# Altium schematic sheet Bluetooth.SchDoc: Transmission Circuit
size B; Date: 2/27/2025; Author: Brach Knutson; Organization: ORGANIZATION; Address1: ADDRESS 1; Address2: ADDRESS 2; Address3: ADDRESS 3; Address4: ADDRESS 4; Revision: -; SheetNumber: 4; SheetTotal: 6; ENG_APP_DATE: --/--/--; DSN_APP_DATE: --/--/--; CHK_APP_DATE: --/--/--
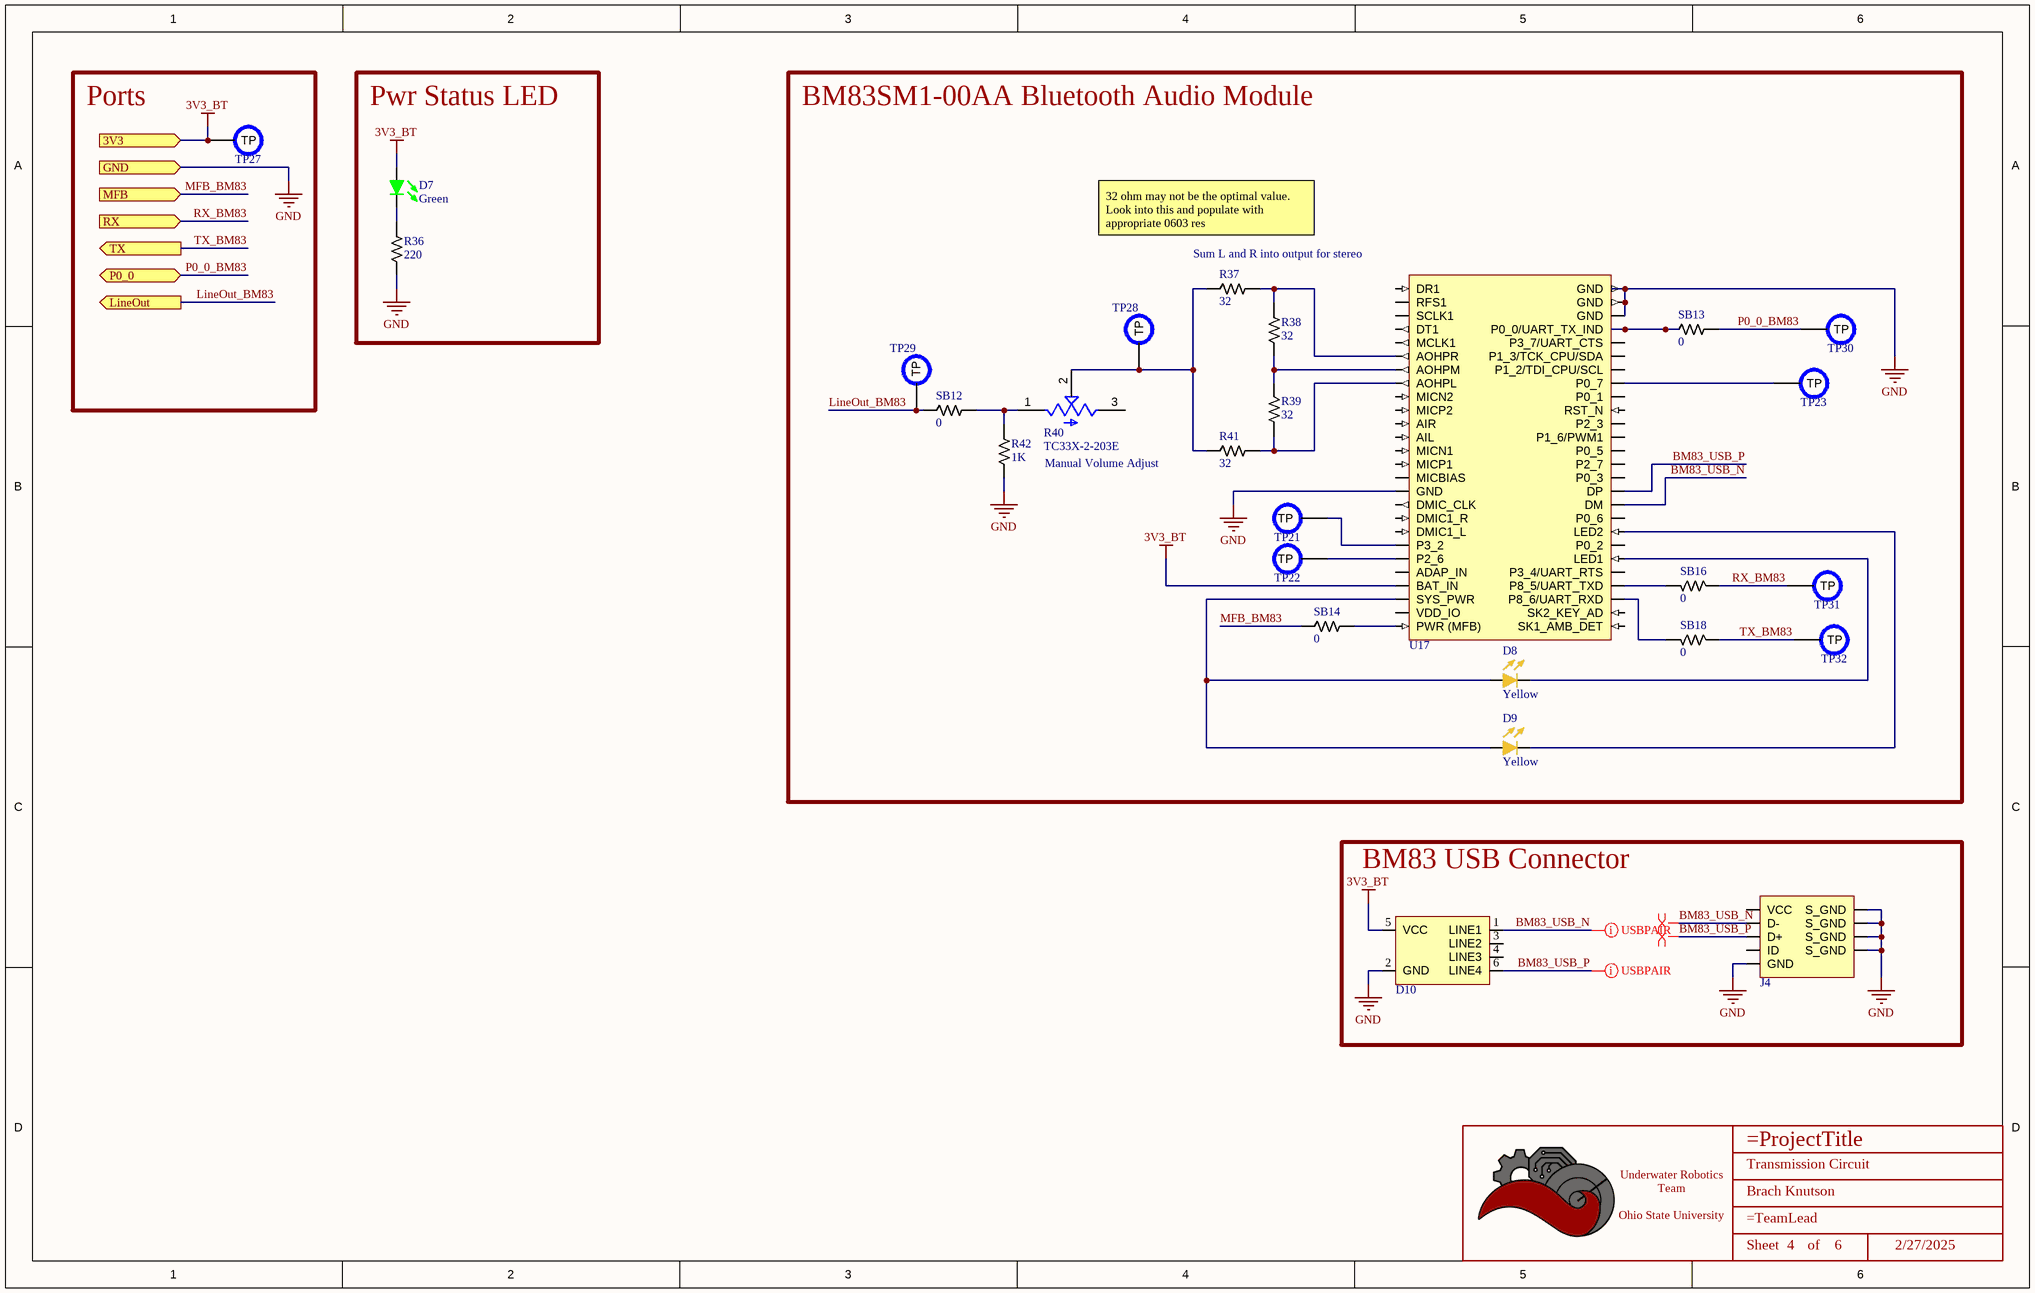
[diagram p0: Bluetooth.SchDoc]

## Parts
*  Title_Block  [LOGO]  (value not drawn)  (graphical)
D7  Color: Green  [LED_0603]  (hidden comment: 150060GS75000)
D8  Color: Yellow  [LED_0603]  (hidden comment: 150060YS75000)
D9  Color: Yellow  [LED_0603]  (hidden comment: 150060YS75000)
D10  TVS DIODE 5VWM 25VC SOT23-6  [SOT 23-6L]  (value not drawn)
J4  USB_MICRO R/A  [CONN_MINIUSB]  (value not drawn)
R36  Value  (Ohms): 220  [RESISTOR_0603]  (hidden comment: 220 Ohm 5% 1/8W)
R37  value 32  [RESISTOR_0603]  (hidden comment: RN73R1JTTD32R0D25)
R38  value 32  [RESISTOR_0603]  (hidden comment: RN73R1JTTD32R0D25)
R39  value 32  [RESISTOR_0603]  (hidden comment: RN73R1JTTD32R0D25)
R40  TC33X-2-203E  [TRIM_TC33X-2-203E]
R41  value 32  [RESISTOR_0603]  (hidden comment: RN73R1JTTD32R0D25)
R42  Value  (Ohms): 1K  [RESISTOR_0603]  (hidden comment: 1k Ohm 5% 1/8W)
SB12  Value  (Ohms): 0  [RESISTOR_0603]  (hidden comment: 0 Ohm Jumper No Fit)
SB13  Value  (Ohms): 0  [RESISTOR_0603]  (hidden comment: 0 Ohm Jumper No Fit)
SB14  Value  (Ohms): 0  [RESISTOR_0603]  (hidden comment: 0 Ohm Jumper No Fit)
SB16  Value  (Ohms): 0  [RESISTOR_0603]  (hidden comment: 0 Ohm Jumper No Fit)
SB18  Value  (Ohms): 0  [RESISTOR_0603]  (hidden comment: 0 Ohm Jumper No Fit)
TP21  PCB Test Point  [TESTPOINT_1.2MM]  (value not drawn)  (no BOM)
TP22  PCB Test Point  [TESTPOINT_1.2MM]  (value not drawn)  (no BOM)
TP23  PCB Test Point  [TESTPOINT_1.2MM]  (value not drawn)  (no BOM)
TP27  PCB Test Point  [TESTPOINT_1.2MM]  (value not drawn)  (no BOM)
TP28  PCB Test Point  [TESTPOINT_1.2MM]  (value not drawn)  (no BOM)
TP29  PCB Test Point  [TESTPOINT_1.2MM]  (value not drawn)  (no BOM)
TP30  PCB Test Point  [TESTPOINT_1.2MM]  (value not drawn)  (no BOM)
TP31  PCB Test Point  [TESTPOINT_1.2MM]  (value not drawn)  (no BOM)
TP32  PCB Test Point  [TESTPOINT_1.2MM]  (value not drawn)  (no BOM)
U17  RF TXRX MOD BT PCB TH SMD  [BM83SM1-00AA]  (value not drawn)

## Blocks framed on the sheet
Ports: TP27
Pwr Status LED: D7 R36
BM83SM1-00AA Bluetooth Audio Module: D8 D9 R37-R42 SB12-SB14 SB16 SB18 TP21-TP23 TP28-TP32 U17
BM83 USB Connector: D10 J4

## Ports
3V3 (in), GND (in), LineOut (out), MFB (in), P0_0 (bidir), RX (in), TX (out)

## Nets
3V3_BT: D7.1 D10.5(VCC) TP27.TP U17.23(BAT_IN) ; port 3V3
GND: D10.2(GND) J4.5(GND) J4.6(S_GND) J4.7(S_GND) J4.8(S_GND) J4.9(S_GND) R36.2 R42.2 U17.16(GND) U17.50(GND) U17.51(GND) U17.52(GND) ; port GND
BM83_USB_N: D10.1(LINE1) J4.2(D-) U17.36(DM)
BM83_USB_P: D10.6(LINE4) J4.3(D+) U17.37(DP)
LineOut_BM83: SB12.2 TP29.TP ; port LineOut
MFB_BM83: SB14.2 ; port MFB
P0_0_BM83: SB13.1 TP30.TP ; port P0_0
RX_BM83: SB16.2 TP31.TP ; port RX
TX_BM83: SB18.2 TP32.TP ; port TX
NetD7_2: D7.2 R36.1
NetD8_1: D8.1 D9.1 U17.24(SYS_PWR)
NetD8_2: D8.2 U17.32(LED1)
NetD9_2: D9.2 U17.34(LED2)
NetR37_1: R37.1 R38.1 U17.6(AOHPR)
NetR37_2: R37.2 R40.2(W) R41.2 TP28.TP
NetR38_2: R38.2 R39.2 U17.7(AOHPM)
NetR39_1: R39.1 R41.1 U17.8(AOHPL)
NetR40_1: R40.1(CCW) R42.1 SB12.1
NetSB13_2: SB13.2 U17.49(P0_0/UART_TX_IND)
NetSB14_1: SB14.1 U17.26(PWR_(MFB))
NetSB16_1: SB16.1 U17.30(P8_5/UART_TXD)
NetSB18_1: SB18.1 U17.29(P8_6/UART_RXD)
NetTP21_TP: TP21.TP U17.20(P3_2)
NetTP22_TP: TP22.TP U17.21(P2_6)
NetTP23_TP: TP23.TP U17.45(P0_7)

Not connected (* = marked no-connect by the designer): D10 3(LINE2) 4(LINE3); J4 1(VCC) 4(ID); R40 3(CW); U17 1(DR1) 2(RFS1) 3(SCLK1) 4(DT1) 5(MCLK1) 9(MICN2) 10(MICP2) 11(AIR) 12(AIL) 13(MICN1) 14(MICP1) 15(MICBIAS) 17(DMIC_CLK) 18(DMIC1_R) 19(DMIC1_L) 22(ADAP_IN) 25(VDD_IO) 27(SK1_AMB_DET) 28(SK2_KEY_AD) 31(P3_4/UART_RTS) 33(P0_2) 35(P0_6) 38(P0_3) 39(P2_7) 40(P0_5) 41(P1_6/PWM1) 42(P2_3) 43(RST_N) 44(P0_1) 46(P1_2/TDI_CPU/SCL) 47(P1_3/TCK_CPU/SDA) 48(P3_7/UART_CTS)

## Layout directives
differential pair: BM83_USB_N, BM83_USB_P

## Notes on the sheet
- 32 ohm may not be the optimal value. Look into this and populate with appropriate 0603 res
- Sum L and R into output for stereo
- Manual Volume Adjust
- DWG. NO.
- REV.
- SHT.
- THIS DOCUMENT AND THE DATA DISCLOSED HEREIN OR HEREWITH IS THE PROPERTY OF ALTIUM LIMITED AND MAY BE FREELY DISTRIBUTED IN WHOLE. NO RIGHTS ARE RESERVED OR EXPRESS OR IMPLIED WARANTEE GIVEN.
- REVISION
- DESCRIPTION
- DATE
- APPROVED
- ENG:
- APPROVALS
- PROJECT
- DSN:
- CHK:
- REFERENCE DOCUMENTS
- PROJECT REVISION:
- TITLE
- DOCUMENT REVISION:
- DESIGN ITEM:
- BOM:
- FAB DWG:
- PCB DWG:
- ASSY DWG:
- SCALE:
- SIZE
- B
- CAGE CODE
- FILE NAME
- DWG NO.
- SHEET
- OF
- REV
- (in symbol Title_Block) Underwater Robotics Team / Ohio State University; Sheet; of

## Library data of the parts
* = Title_Block: UWRT Schematic Title Block Template / Created June 2021, Dylan Trainor
D7 = LED_Green_0603_3.2V: LED Green Vf= 3.2V If = 0.025A / 150060GS75000; Made By: Flip B; Forward Current: 25mA; Supplier 1: Digi-Key; ComponentLink1Description: Datasheet; ComponentLink1URL: https://www.we-online.de/katalog/datasheet/150060GS75000.pdf; Supplier Part Number 1: 732-4971-1-ND; Forward Voltage: 3.2V; Package: 0603
D8 D9 = LED_Yellow_0603: LED Yellow Vf= 2V If = 0.020A / 150060YS75000; Made By: Robert Pafford; Forward Current: 20mA; Forward Voltage: 2V; Package: 0603; Supplier 1: Digi-Key; Supplier Part Number 1: 732-4981-1-ND
D10 = RCLAMP0504S.TCT: 25V Clamp 6A (8/20µs) Ipp Tvs Diode Surface Mount SOT-23-6; Made By: Robert Pafford; Reverse Standoff Voltage (Typ): 5V; Breakdown Voltage (Min): 6V; Supplier 1: Digi-Key; Supplier Part Number 1: RCLAMP0504SCT-ND; Clamping Voltage (Max): 25V
J4 = CONN_MICROUSB: Amphenol Micro USB-B / USB2.0 5 Pin Right Angle SMD; Pitch: 0.65mm; Current Per Pin: 1.8A; Number of Positions: 5; Manufacturer: Amphenol; Configuration: Right Angle; Color: Silver; Created By: Flip B; ComponentLink1Description: Datasheet; ComponentLink1URL: https://cdn.amphenol-icc.com/media/wysiwyg/files/documentation/datasheet/inputoutput/io_usb_micro.pdf?__cf_chl_jschl_tk__=05693735e19256298f6ef6ca2bb2e65c376a4f56-1625503833-0-Abitsb0-ufjOXJYs_S3J3r2iTn-nObalbmXUksF1VvO_h_WEmRdMlUD1I8-hmWSEVWzY1pirKnrPZWfgY3851qyBZe5ZvnNQePLGIzUgdEIQBVUyW36RsbYpDLEWxJ4horD-5gChFgobLYqwmG5aHl0E8lIn_twwPPrOxilK2gP0q9t_CNOs_u5fMqXvXUrlsOv8tIE2NRlu6NVP8qtkL2GjhlkeTUbDMF8WvvpPDTFOgvZ4Y16Ej8F8AhWos88mo5B1HssXozw0XrkJQIqERITUu6rqloz9kf4ZzhBHtDAt-IkiAFY_Ds9SW8FYKKTtINJVpHZQ6Gyu1FFM4Dc9MO0maE8_mmNcwlxqyRoRk_MPWW8VyByXWM5RSp52jteRKw7FeI9WIYvCbPAOy0Eyib-aseIQsnGbglBcUY6_2xp8GYaJM38H3dNvBPsSOfJBPndKedwKHllxjkucXn6xsN0sDXkpGN-cu8_2bDTJ0g-uUucKSCooYX-ApSDNGpkA_p9zv1SOAD8c0zaZVmtiBsN75QpVz2rzq9_BFxOywPvR; Series: 10118192; Supplier 1: Digi-Key; Supplier Part Number 1: 609-4613-1-ND
R36 = RESISTOR_200_0603: RES 220 OHM 5% 1/8W 0603; Tolerance: +/- 5%; Made By: John S; ComponentLink1Description: Digikey; ComponentLink1URL: https://www.digikey.com/en/products/detail/koa-speer-electronics-inc/RK73B1JTTD101J/9844701; Wattage: 1/8W; Supplier 1: Digi-Key; Supplier Part Number 1: 2019-RK73B1JTTD221JCT-ND
R37-R39 R41 = RES 32 OHM 0.5% 1/10W 0603: 32 Ohms ±0.5% 0.125W, 1/8W Chip Resistor 0603 (1608 Metric) Automotive AEC-Q200, Moisture Resistant Thin Film
R40 = TC33X-2-203E: 20 kOhms 0.1W, 1/10W J Lead Surface Mount Trimmer Potentiometer Cermet 1 Turn Top Adjustment; MF: Bourns; Value: *; SnapEDA_Link: https://www.snapeda.com/parts/TC33X-2-203E/Bourns/view-part/312812/?ref=snap; Check_prices: https://www.snapeda.com/parts/TC33X-2-203E/Bourns/view-part/312812/?ref=eda; Digi-Key_Part_Number: TC33X-2-203ECT-ND; Purchase-URL: https://pricing.snapeda.com/search/part/TC33X-2-203E/?ref=eda; Package: 1608 Bourns; MP: TC33X-2-203E; Supplier 1: Mouser; Supplier Part Number 1: 652-TC33X-2-203E
R42 = RESISTOR_1K_0603: RES 1k OHM 5% 1/8W 0603; Tolerance: +/- 5%; Made By: Robert Pafford; ComponentLink1Description: Datasheet; ComponentLink1URL: https://www.bourns.com/docs/product-datasheets/CRxxxxx.pdf; Wattage: 1/8W; Supplier: Digikey; Digikey Part Numer: CR0603-JW-104ELFTR-ND; Supplier 1: Digi-Key; Supplier Part Number 1: 2019-RK73B1JTTD102JCT-ND
SB12-SB14 SB16 SB18 = JUMPER_0_0603: 0 Ohm Jumper No Fit for Solder Bridge; Made By: Robert Pafford; ComponentLink1Description: Digikey; ComponentLink1URL: https://www.digikey.com/en/products/detail/koa-speer-electronics-inc/RK73B1JTTD101J/9844701
TP21-TP23 TP27-TP32 = TESTPOINT: Made By: Robert Pafford
U17 = BM83SM1-00AA: Bluetooth Bluetooth v5.0 Transceiver Module 2.4GHz ~ 2.48GHz PCB Trace Surface Mount